# EAGLE design kick_2021_03 (EAGLE 9.6.1)
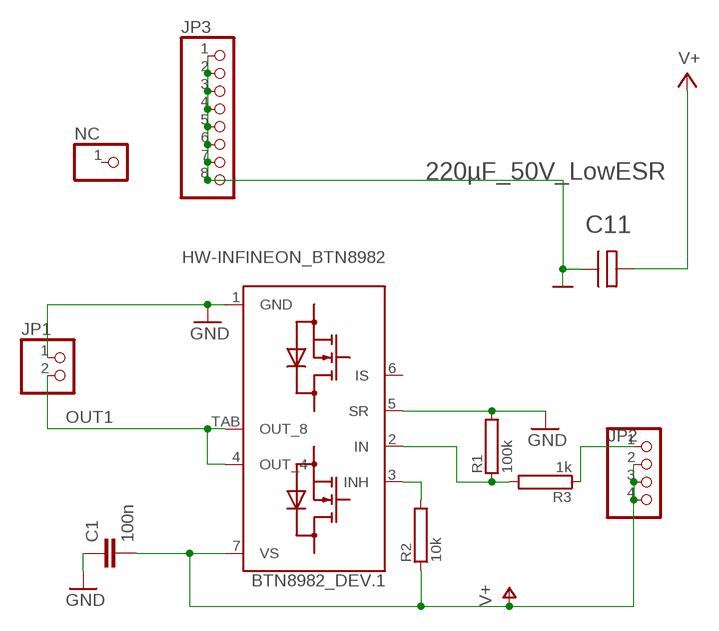
[diagram p0: schematic, sheet 1]

## Parts
BTN8982_DEV.1  HW-INFINEON_BTN8982  HW-INFINEON_BTN8962TA  [HW-INFINEON_TO263-7-1]
C1  100n  CAP0603-CAP  [0603-CAP]
C11  220µF_50V_LowESR  470µFSMD  [470µF/SMD/16V]
JP1  PINHD-1X2/90  [1X02/90]
JP2  PINHD-1X4  [1X04]
JP3  PINHD-1X8  [1X08]
NC  PINHD-1X1  [1X01]
R1  100k  06030603  [0603]
R2  10k  06030603  [0603]
R3  1k  06030603  [0603]

## Nets
GND: BTN8982_DEV.1.1(GND) BTN8982_DEV.1.5(SR) C1.1 C11.- JP1.1 JP3.1 JP3.2 JP3.3 JP3.4 JP3.5 JP3.6 JP3.7 JP3.8 R1.2
N$1: BTN8982_DEV.1.3(INH) R2.2
N$2: BTN8982_DEV.1.2(IN) R1.1 R3.2
N$3: JP2.1 R3.1
OUT1: BTN8982_DEV.1.4(OUT_4) BTN8982_DEV.1.TAB(OUT_8) JP1.2
V+: BTN8982_DEV.1.7(VS) C1.2 C11.+ JP2.2 JP2.3 JP2.4 R2.1
Unconnected: BTN8982_DEV.1.6(IS) NC.1

## Library data of the parts
BTN8982_DEV.1 = NovalithIC_H-Bridge_Demo_Board_V2_2:HW-INFINEON_BTN8962TA
C1 = SparkFun:CAP: Capacitor Standard 0603 ceramic capacitor, and 0.1" leaded capacitor.
C11 = ELKO:470µF
JP1 = pinhead@1:PINHD-1X2: PIN HEADER
JP2 = pinhead:PINHD-1X4: PIN HEADER
JP3 = pinhead:PINHD-1X8: PIN HEADER
NC = pinhead:PINHD-1X1: PIN HEADER
R1-R3 = R:0603

## Board
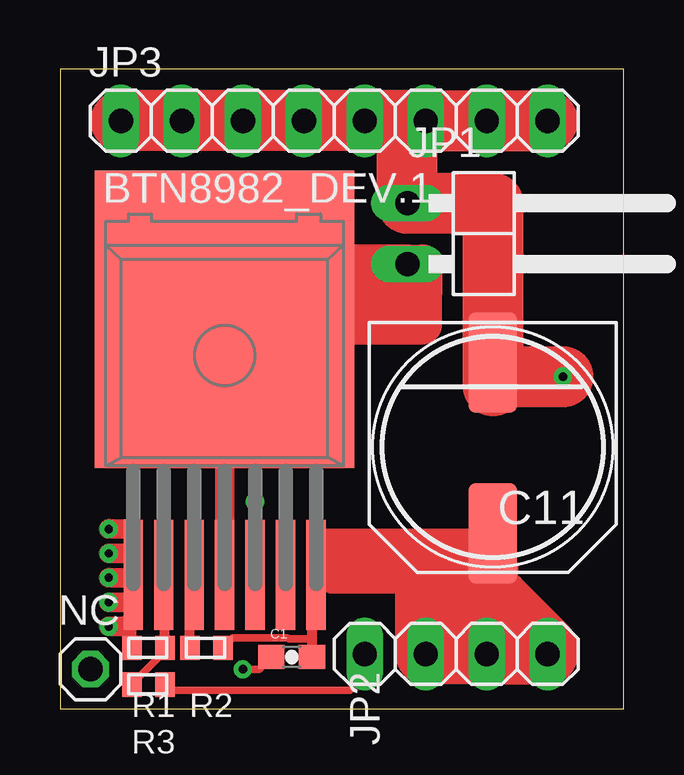
[diagram p1: board, top side]
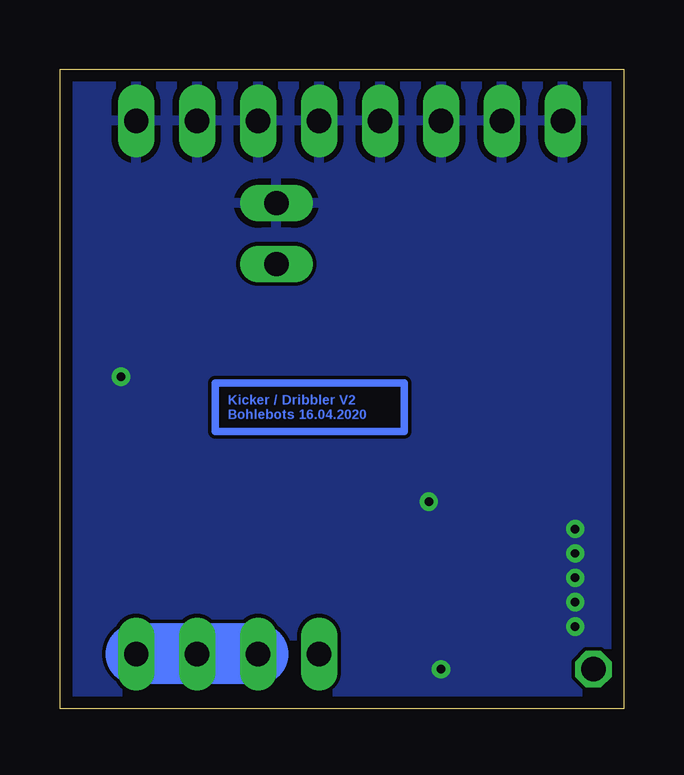
[diagram p2: board, bottom side, seen from below]

Size 23.49 x 26.67 mm. Coordinates in mm from the lower left corner, seen from the top.
Outline: 0,0 23.49,0 23.49,26.67 0,26.67 0,0
Copper layers (1*16): Top 0.035mm / dielectric 1.5mm / Bottom 0.035mm
Design rules "default *": minimum track width 6mil, minimum drill 0.35mm, track to track 6mil, track to pad 6mil, pad to pad 6mil, via to via 6mil, smd to smd 6mil, copper to edge 20mil, drill to drill 6mil, minimum pad ring 10mil, minimum via ring 8mil, stop-mask expansion 4mil, vias tented up to drill 0mil, thermal gap 10mil

### Footprints (pad centres in the part's own frame; a part is rotated, then mirrored left to right if it is on the bottom)
HW-INFINEON_TO263-7-1 = smd 0.8 x 4.6: 1 -3.81,-9.15; 2 -2.54,-9.15; 3 -1.27,-9.15; 4 0,-9.15; 5 1.27,-9.15; 6 2.54,-9.15; 7 3.81,-9.15 | smd 10.8 x 12.4: TAB 0,1.5
0603-CAP = smd 1.1 x 1: 1 -0.85,0; 2 0.85,0
470µF/SMD/16V = smd 2.032 x 4.2: + 0,3.61; - 0,-3.51
1X02/90 = drill 1.016 long: 1 -1.27,-3.81; 2 1.27,-3.81
1X04 = drill 1.016 long: 1 -3.81,0; 2 -1.27,0; 3 1.27,0; 4 3.81,0
1X08 = drill 1.016 long: 1 -8.89,0; 2 -6.35,0; 3 -3.81,0; 4 -1.27,0; 5 1.27,0; 6 3.81,0; 7 6.35,0; 8 8.89,0
1X01 = drill 1.016 octagon: 1 0,0
0603 = smd 0.813 x 1.016: 1 -0.686,0; 2 0.686,0

### Placement (x,y rotation side)
BTN8982_DEV.1  6.86,14.73 0 top
C1  9.65,2.16 0 top
C11  18.03,10.92 180 top
JP1  18.29,19.81 270 top
JP2  16.51,2.29 0 top
JP3  11.43,24.51 0 top
NC  1.27,1.65 0 top
R1  3.68,2.54 180 top
R2  6.1,2.54 180 top
R3  3.68,1.02 180 top

### Tracks (layer width: path | path; a pad name or v marks a point on that pad's centre or on a via)
GND  (via drill 0.35)
  Top 0.305: C1.1 8.29,1.65 v7.62,1.65 | BTN8982_DEV.1.5 v8.13,8.64
  Top 0.406: R1.2 3,3.68 3,4.57 3,5.53 BTN8982_DEV.1.1
  Top 0.813: v2.03,7.49 3.05,7.49 | v2.03,6.48 3.05,6.48 | v2.03,5.46 2.93,5.46 3,5.53 | v2.03,4.45 2.87,4.45 3,4.57 | v2.03,3.43 2.74,3.43 3,3.68
  Top 2.54: C11.- 18.03,21.08 JP1.1 14.48,23.75 JP3.6 | C11.- 18.03,13.46 | JP3.6 JP3.7 JP3.8 | JP3.6 JP3.5 JP3.4 JP3.3 JP3.2 JP3.1 | C11.- 18.62,13.84 v20.95,13.84
  pour Bottom: -1.4,-1.14 -1.4,29.97 26.42,29.97 26.42,-1.14
N$1
  Top 0.406: R2.2 5.41,5.4 BTN8982_DEV.1.3
N$2
  Top 0.305: R3.2 4.37,2.39 R1.1
  Top 0.406: R1.1 4.37,5.53 BTN8982_DEV.1.2
N$3
  Top 0.305: JP2.1 12.7,1.4 12.06,0.76 4.62,0.76 R3.1
N$4
  Bottom 0.305: 9.14,13.59 17.02,13.59 17.02,11.56 9.14,11.56 9.14,13.59
OUT1
  Top 0.813: BTN8982_DEV.1.4 BTN8982_DEV.1.TAB
  Top 1.626: 6.86,17.27 6.86,18.54 JP1.2 15.11,18.54 15.11,17.27 | 6.86,17.27 BTN8982_DEV.1.TAB 7.09,16 15.11,16 15.11,17.27 | 15.11,17.27 6.86,17.27
V+
  Top 0.305: 10.5,2.92 9.52,2.92 9.48,2.96 7.21,2.96 R2.1
  Top 0.406: C1.2 10.5,2.92 10.5,5.42 BTN8982_DEV.1.7
  Top 0.813: 18.29,5.84 18.03,5.84 17.4,5.84 14.99,5.84 10.93,5.84 BTN8982_DEV.1.7 10.93,5.58 11.3,5.21 18.29,5.21 | C11.+ 17.83,7.11 10.67,7.11 | C11.+ 17.2,6.48 10.67,6.48 | C11.+ 18.03,4.32
  Top 1.626: 18.29,4.57 18.29,5.84 | 18.03,5.84 C11.+ 17.4,6.68
  Top 2.54: JP2.3 JP2.4 20.32,2.54 18.29,4.57 18.03,4.32 17.78,4.06 JP2.3 | JP2.3 JP2.2 15.24,5.59 14.99,5.84 | JP2.3 17.78,5.46 17.4,5.84
  Bottom 2.54: JP2.2 JP2.4

### Text on the board
Bottom: Kicker / Dribbler V2 / Bohlebots 16.04.2020